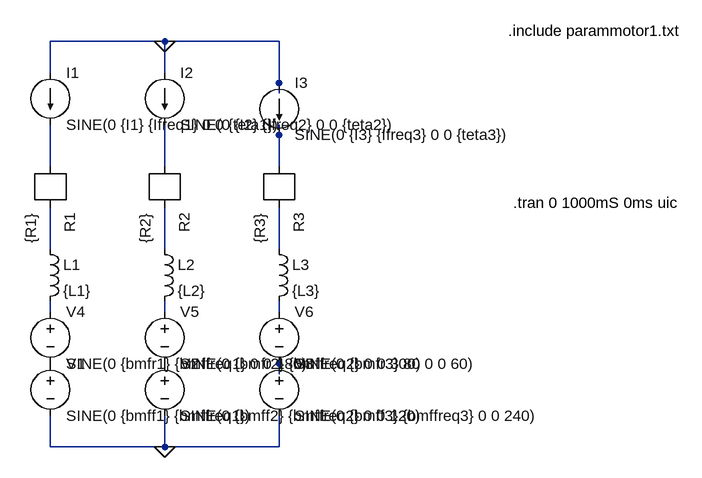
[diagram p0: schematic motor1.asc]
motor1.asc, the LTspice schematic file:
Version 4
SHEET 1 1408 680
WIRE 544 -208 368 -208
WIRE 720 -208 544 -208
WIRE 368 -160 368 -208
WIRE 544 -160 544 -208
WIRE 720 -144 720 -208
WIRE 720 -128 720 -144
WIRE 720 -64 720 -80
WIRE 368 -16 368 -80
WIRE 544 -16 544 -80
WIRE 720 -16 720 -64
WIRE 368 112 368 48
WIRE 544 112 544 48
WIRE 720 112 720 48
WIRE 368 208 368 192
WIRE 544 208 544 192
WIRE 720 208 720 192
WIRE 720 304 720 288
WIRE 368 416 368 368
WIRE 544 416 544 368
WIRE 544 416 368 416
WIRE 720 416 720 368
WIRE 720 416 544 416
FLAG 544 416 0
FLAG 544 -208 0
SYMBOL voltage 368 272 R0
SYMATTR InstName V1
SYMATTR Value SINE(0 {bmff1} {bmffreq1})
SYMBOL voltage 544 272 R0
SYMATTR InstName V2
SYMATTR Value SINE(0 {bmff2} {bmffreq2} 0 0 120)
SYMBOL voltage 720 272 R0
SYMATTR InstName V3
SYMATTR Value SINE(0 {bmff3} {bmffreq3} 0 0 240)
SYMBOL r 368 -16 R90
SYMATTR InstName R1
SYMATTR Value {R1}
SYMBOL r 544 -16 R90
SYMATTR InstName R2
SYMATTR Value {R2}
SYMBOL r 720 -16 R90
SYMATTR InstName R3
SYMATTR Value {R3}
SYMBOL ind 352 96 R0
SYMATTR InstName L1
SYMATTR Value {L1}
SYMBOL ind 528 96 R0
SYMATTR InstName L2
SYMATTR Value {L2}
SYMBOL ind 704 96 R0
SYMATTR InstName L3
SYMATTR Value {L3}
SYMBOL current 368 -160 R0
SYMATTR InstName I1
SYMATTR Value SINE(0 {I1} {Ifreq1} 0 0 {teta1})
SYMBOL current 544 -160 R0
SYMATTR InstName I2
SYMATTR Value SINE(0 {I2} {Ifreq2} 0 0 {teta2})
SYMBOL current 720 -144 R0
SYMATTR InstName I3
SYMATTR Value SINE(0 {I3} {Ifreq3} 0 0 {teta3})
SYMBOL voltage 368 192 R0
SYMATTR InstName V4
SYMATTR Value SINE(0 {bmfr1} {bmffreq1} 0 0 180)
SYMBOL voltage 544 192 R0
SYMATTR InstName V5
SYMATTR Value SINE(0 {bmfr2} {bmffreq2} 0 0 300)
SYMBOL voltage 720 192 R0
SYMATTR InstName V6
SYMATTR Value SINE(0 {bmfr3} 80 0 0 60)
TEXT 1080 40 Left 2 !.tran 0 1000mS 0ms uic
TEXT 1072 -224 Left 2 !.include parammotor1.txt

The netlist it stands for:
* motor1.asc
V1 P001 0 SINE(0 {bmff1} {bmffreq1})
V2 P002 0 SINE(0 {bmff2} {bmffreq2} 0 0 120)
V3 N010 0 SINE(0 {bmff3} {bmffreq3} 0 0 240)
R1 N004 N002 {R1}
R2 N005 N003 {R2}
R3 N006 N001 {R3}
L1 N004 N007 {L1}
L2 N005 N008 {L2}
L3 N006 N009 {L3}
I1 0 N002 SINE(0 {I1} {Ifreq1} 0 0 {teta1})
I2 0 N003 SINE(0 {I2} {Ifreq2} 0 0 {teta2})
I3 0 N001 SINE(0 {I3} {Ifreq3} 0 0 {teta3})
V4 N007 P001 SINE(0 {bmfr1} {bmffreq1} 0 0 180)
V5 N008 P002 SINE(0 {bmfr2} {bmffreq2} 0 0 300)
V6 N009 N010 SINE(0 {bmfr3} 80 0 0 60)
.tran 0 1000mS 0ms uic
.include parammotor1.txt
.backanno
.end